# Altium schematic sheet MiniBMS.SchDoc
size A2; SheetNumber: 1; SheetTotal: 1
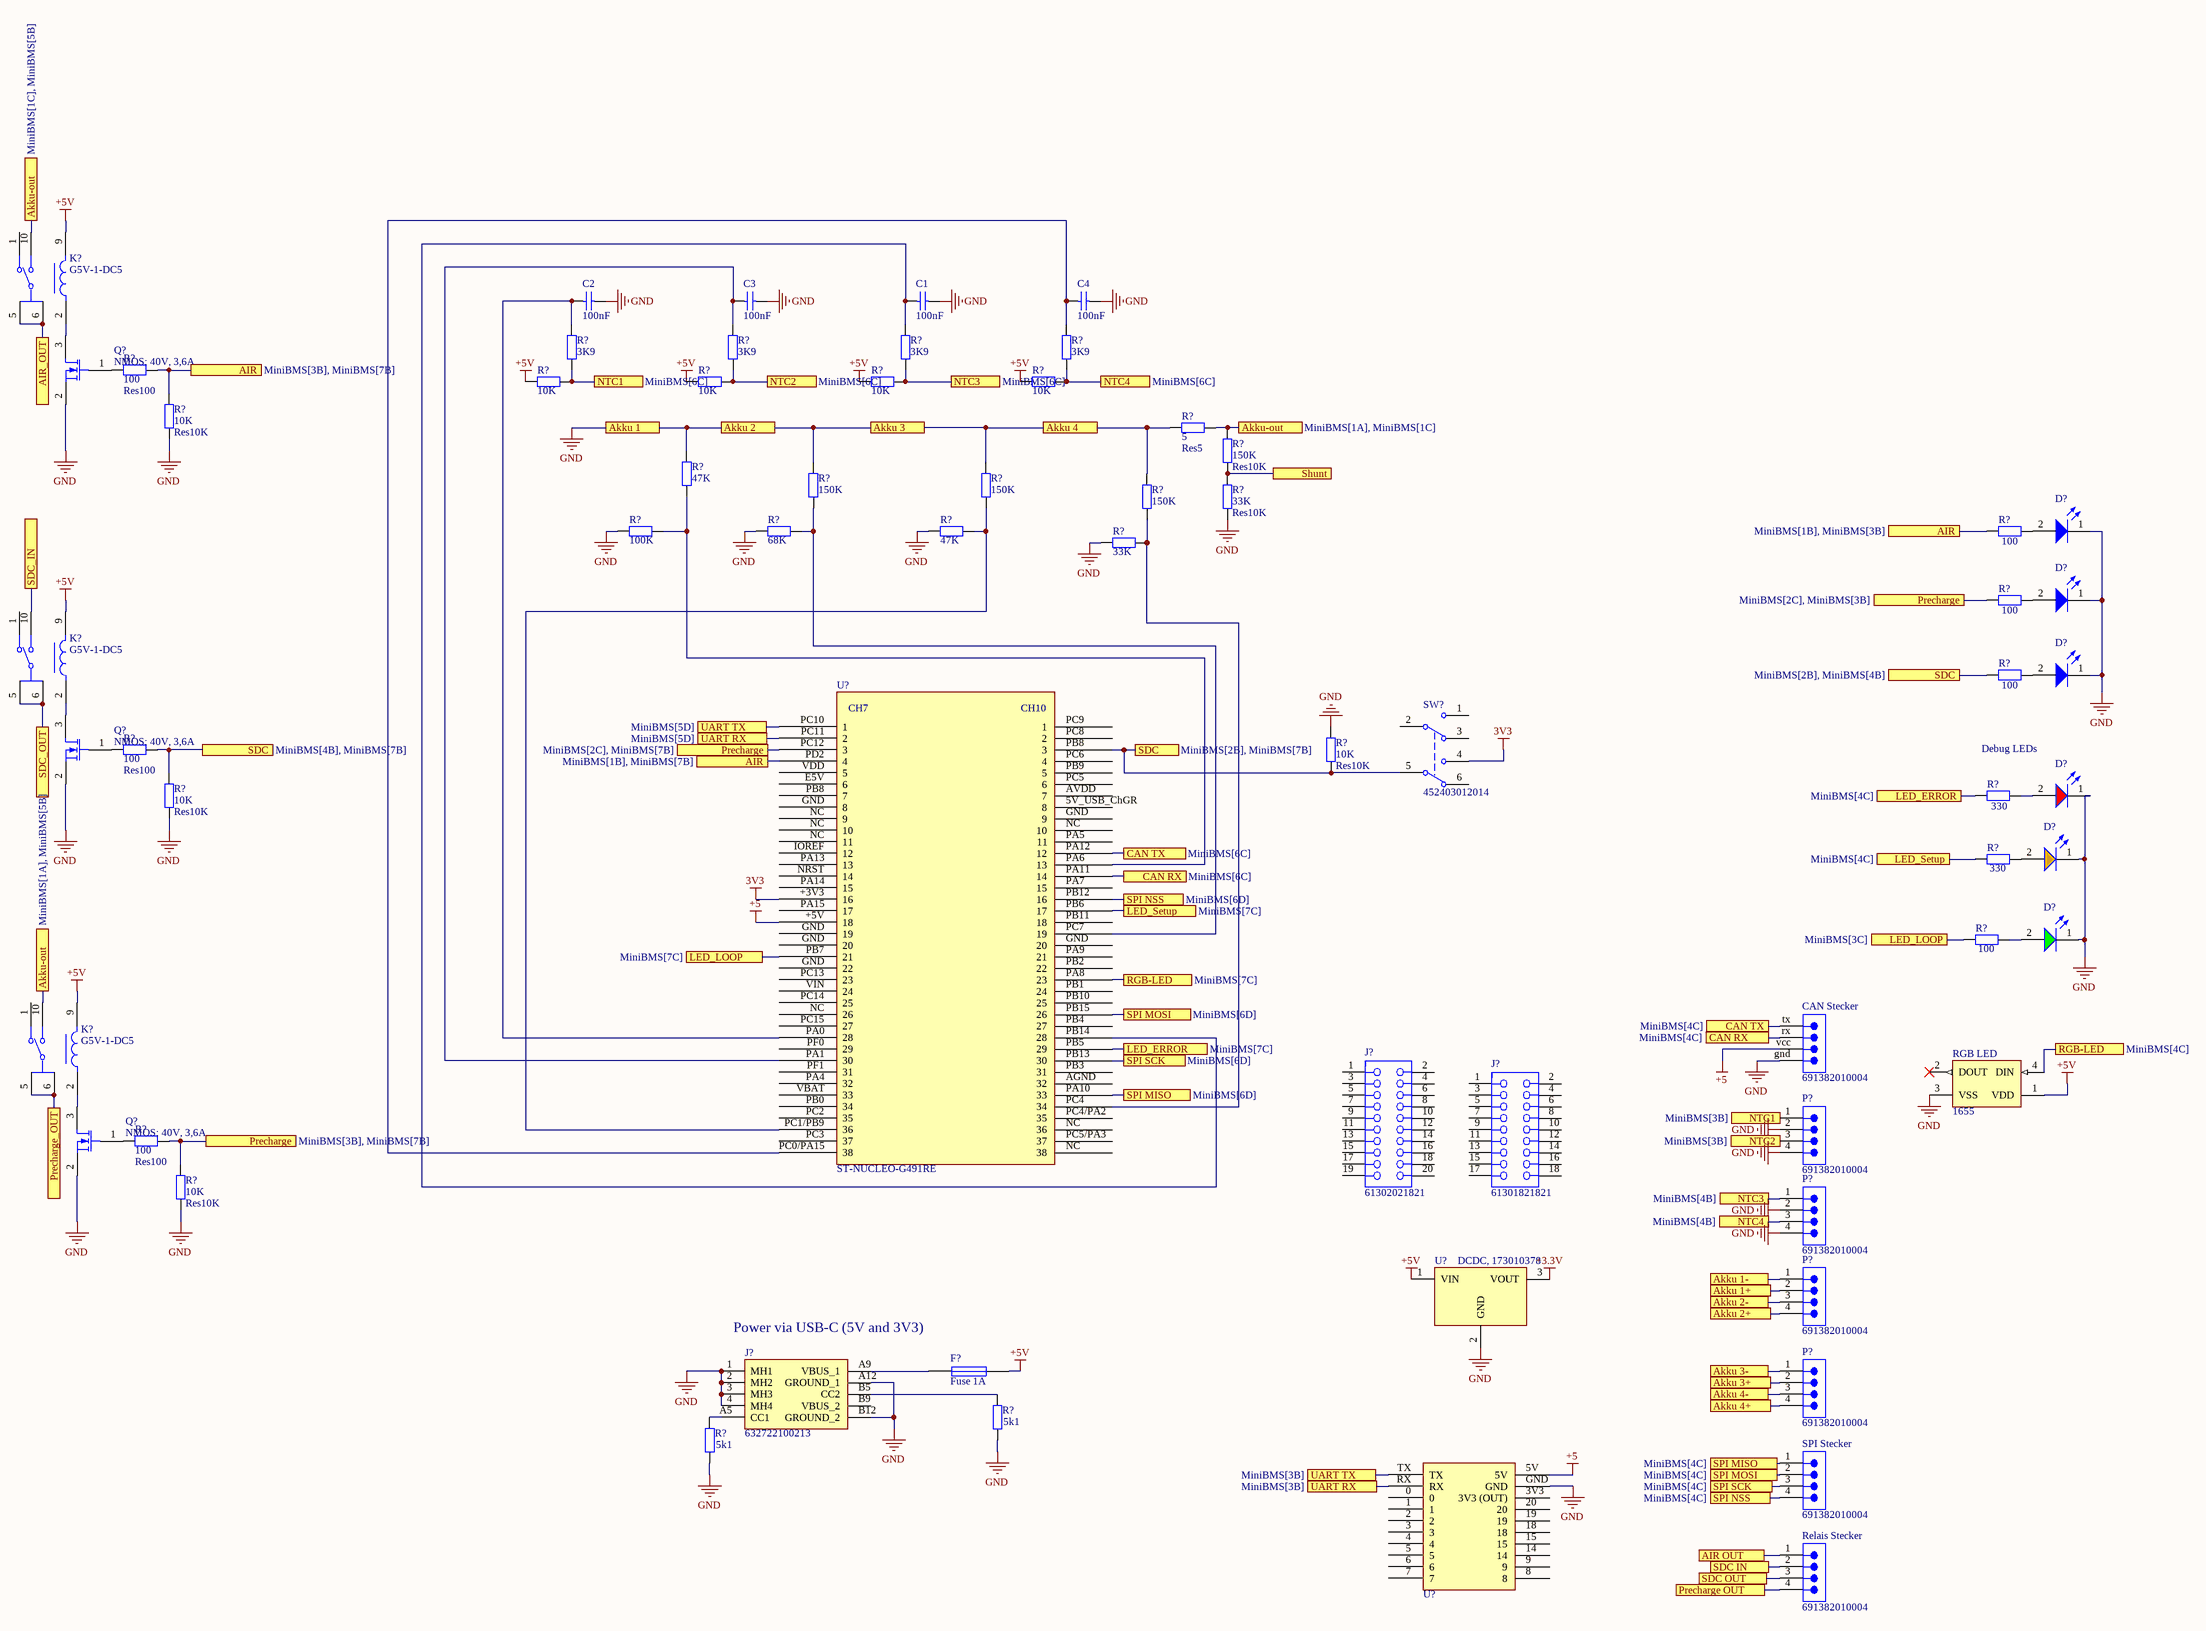
[diagram p0: MiniBMS.SchDoc]

## Parts
(Parts that share a designator on the sheet are numbered #1, #2 ... from top to bottom, then left to right.)
C1  value 100nF  (hidden comment: Capacitor)
C2  value 100nF  (hidden comment: Capacitor)
C3  value 100nF  (hidden comment: Capacitor)
C4  value 100nF  (hidden comment: Capacitor)
CAN_Stecker  691382010004  [691382010004]
D?#1  150080BS75000  [WL-SMCW_0805_150080xx75000]  (value not drawn)
D?#2  150080BS75000  [WL-SMCW_0805_150080xx75000]  (value not drawn)
D?#3  150080BS75000  [WL-SMCW_0805_150080xx75000]  (value not drawn)
D?#4  150080RS75000  [WL-SMCW_0805_150080xx75000]  (value not drawn)
D?#5  150080AS75000  [WL-SMCW_0805_150080xx75000]  (value not drawn)
D?#6  150080GS75000  [WL-SMCW_0805_150080xx75000]  (value not drawn)
F?  Fuse 1A  [OMT125]
J?#1  61302021821  [61302021821]
J?#2  61301821821  [61301821821]
J?#3  632722100213  [632722100213]
K?#1  G5V-1-DC5  [FP-G5V-1-MFG]
K?#2  G5V-1-DC5  [FP-G5V-1-MFG]
K?#3  G5V-1-DC5  [FP-G5V-1-MFG]
P?#1  691382010004  [691382010004]
P?#2  691382010004  [691382010004]
P?#3  691382010004  [691382010004]
P?#4  691382010004  [691382010004]
Q?#1  NMOS; 40V, 3,6A  [SOT-23_M]
Q?#2  NMOS; 40V, 3,6A  [SOT-23_M]
Q?#3  NMOS; 40V, 3,6A  [SOT-23_M]
R?#1  value 3K9  [6-0805_M]
R?#2  value 3K9  [6-0805_M]
R?#3  value 3K9  [6-0805_M]
R?#4  value 3K9  [6-0805_M]
R?#5  value 10K  [6-0805_M]
R?#6  value 10K  [6-0805_M]
R?#7  value 10K  [6-0805_M]
R?#8  value 10K  [6-0805_M]
R?#9  Res100  value 100  [6-0805_M]
R?#10  Res5  value 5  [6-0805_M]
R?#11  Res10K  value 10K  [6-0805_M]
R?#12  value 47K  [6-0805_M]
R?#13  Res10K  value 150K  [6-0805_M]
R?#14  value 150K  [6-0805_M]
R?#15  value 150K  [6-0805_M]
R?#16  value 150K  [6-0805_M]
R?#17  Res10K  value 33K  [6-0805_M]
R?#18  value 100K  [6-0805_M]
R?#19  value 68K  [6-0805_M]
R?#20  value 47K  [6-0805_M]
R?#21  value 100  [6-0805_M]  (hidden comment: Res100,0805)
R?#22  value 33K  [6-0805_M]
R?#23  value 100  [6-0805_M]  (hidden comment: Res100,0805)
R?#24  value 100  [6-0805_M]  (hidden comment: Res100,0805)
R?#25  Res100  value 100  [6-0805_M]
R?#26  Res10K  value 10K  [6-0805_M]
R?#27  value 330  [6-0805_M]  (hidden comment: Res330,0805)
R?#28  Res10K  value 10K  [6-0805_M]
R?#29  value 330  [6-0805_M]  (hidden comment: Res330,0805)
R?#30  value 100  [6-0805_M]  (hidden comment: Res100,0805)
R?#31  Res100  value 100  [6-0805_M]
R?#32  Res10K  value 10K  [6-0805_M]
R?#33  value 5k1  [6-0805_M]  (hidden comment: Res5k1,0805)
R?#34  value 5k1  [6-0805_M]  (hidden comment: Res5k1,0805)
Relais_Stecker  691382010004  [691382010004]
RGB_LED  1655  [ADA-RGB-1655_V]
SPI_Stecker  691382010004  [691382010004]
SW?  452403012014  [452403012014]
U?#1  ST-NUCLEO-G491RE  [NUCLEO-G491RE]
U?#2  DCDC, 173010378  [WPME-FDSM_SIP-3_L11.6W8.5H10.5]
U?#3  EP32_C6_Mini  [ESP_C6_Mini]  (value not drawn)

## Ports
AIR (see MiniBMS[1B], MiniBMS[3B]), AIR (see MiniBMS[1B], MiniBMS[7B]), AIR (see MiniBMS[3B], MiniBMS[7B]), AIR OUT, AIR_OUT, Akku 1, Akku 1+, Akku 1-, Akku 2, Akku 2+, Akku 2-, Akku 3, Akku 3+, Akku 3-, Akku 4, Akku 4+, Akku 4-, Akku-out (see MiniBMS[1A], MiniBMS[1C]), Akku-out (see MiniBMS[1A], MiniBMS[5B]), Akku-out (see MiniBMS[1C], MiniBMS[5B]), CAN RX (see MiniBMS[4C]), CAN RX (see MiniBMS[6C]), CAN TX (see MiniBMS[4C]), CAN TX (see MiniBMS[6C]), LED_ERROR (see MiniBMS[4C]), LED_ERROR (see MiniBMS[7C]), LED_LOOP (see MiniBMS[3C]), LED_LOOP (see MiniBMS[7C]), LED_Setup (see MiniBMS[4C]), LED_Setup (see MiniBMS[7C]), NTC1 (see MiniBMS[3B]), NTC1 (see MiniBMS[6C]), NTC2 (see MiniBMS[3B]), NTC2 (see MiniBMS[6C]), NTC3 (see MiniBMS[4B]), NTC3 (see MiniBMS[6C]), NTC4 (see MiniBMS[4B]), NTC4 (see MiniBMS[6C]), Precharge (see MiniBMS[2C], MiniBMS[3B]), Precharge (see MiniBMS[2C], MiniBMS[7B]), Precharge (see MiniBMS[3B], MiniBMS[7B]), Precharge OUT, Precharge_OUT, RGB-LED (see MiniBMS[4C]), RGB-LED (see MiniBMS[7C]), SDC (see MiniBMS[2B], MiniBMS[4B]), SDC (see MiniBMS[2B], MiniBMS[7B]), SDC (see MiniBMS[4B], MiniBMS[7B]), SDC IN, SDC OUT, SDC_IN, SDC_OUT, Shunt, SPI MISO (see MiniBMS[4C]), SPI MISO (see MiniBMS[6D]), SPI MOSI (see MiniBMS[4C]), SPI MOSI (see MiniBMS[6D]), SPI NSS (see MiniBMS[4C]), SPI NSS (see MiniBMS[6D]), SPI SCK (see MiniBMS[4C]), SPI SCK (see MiniBMS[6D]), UART RX (see MiniBMS[3B]), UART RX (see MiniBMS[5D]), UART TX (see MiniBMS[3B]), UART TX (see MiniBMS[5D])

## Nets
3V3: SW?.4 U?#1.+3V3(16)
+3.3V: U?#2.3(VOUT)
+5: CAN_Stecker.vcc U?#1.+5V(18) U?#3.5V
+5V: F?.2 K?#1.9 K?#2.9 K?#3.9 R?#5.2 R?#6.2 R?#7.2 R?#8.2 RGB_LED.1(VDD) U?#2.1(VIN)
GND: C1.1 C2.1 C3.1 C4.1 CAN_Stecker.gnd D?#1.1(K) D?#2.1(K) D?#3.1(K) D?#4.1(K) D?#5.1(K) D?#6.1(K) J?#3.1(MH1) J?#3.2(MH2) J?#3.3(MH3) J?#3.4(MH4) J?#3.A12(GROUND_1) J?#3.B12(GROUND_2) P?#1.2 P?#1.4 P?#2.2 P?#2.4 Q?#1.2(S) Q?#2.2(S) Q?#3.2(S) R?#10.2 R?#11.1 R?#12.1 R?#14.1 R?#15.1 R?#16.1 R?#17.1 R?#18.2 R?#19.2 R?#20.2 R?#22.2 R?#26.2 R?#28.1 R?#32.1 R?#33.2 R?#34.2 RGB_LED.3(VSS) U?#2.2(GND) U?#3.GND ; port Akku 1, port Akku 2, port Akku 3, port Akku 4
AIR: R?#9.2 R?#11.2 R?#21.1 U?#1.PD2(4) ; port AIR
AIR OUT: Relais_Stecker.1 ; port AIR OUT
AIR_OUT: K?#1.5 K?#1.6 ; port AIR_OUT
Akku 1+: P?#3.2 ; port Akku 1+
Akku 1-: P?#3.1 ; port Akku 1-
Akku 2+: P?#3.4 ; port Akku 2+
Akku 2-: P?#3.3 ; port Akku 2-
Akku 3+: P?#4.2 ; port Akku 3+
Akku 3-: P?#4.1 ; port Akku 3-
Akku 4+: P?#4.4 ; port Akku 4+
Akku 4-: P?#4.3 ; port Akku 4-
Akku-out: K?#1.10 K?#3.10 R?#10.1 R?#13.2 ; port Akku-out
CAN RX: CAN_Stecker.rx U?#1.PA11(14) ; port CAN RX
CAN TX: CAN_Stecker.tx U?#1.PA12(12) ; port CAN TX
LED_ERROR: R?#27.1 U?#1.PB5(29) ; port LED_ERROR
LED_LOOP: R?#30.1 U?#1.PB7(21) ; port LED_LOOP
LED_Setup: R?#29.1 U?#1.PB6(17) ; port LED_Setup
NTC1: P?#1.1 R?#1.1 R?#5.1 ; port NTC1
NTC2: P?#1.3 R?#2.1 R?#6.1 ; port NTC2
NTC3: P?#2.1 R?#3.1 R?#7.1 ; port NTC3
NTC4: P?#2.3 R?#4.1 R?#8.1 ; port NTC4
Precharge: R?#23.1 R?#31.2 R?#32.2 U?#1.PC12(3) ; port Precharge
Precharge OUT: Relais_Stecker.4 ; port Precharge OUT
Precharge_OUT: K?#3.5 K?#3.6 ; port Precharge_OUT
RGB-LED: RGB_LED.4(DIN) U?#1.PA8(23) ; port RGB-LED
SDC: R?#24.1 R?#25.2 R?#26.1 R?#28.2 SW?.5(COM) U?#1.PB8(7) ; port SDC
SDC IN: Relais_Stecker.2 ; port SDC IN
SDC OUT: Relais_Stecker.3 ; port SDC OUT
SDC_IN: K?#2.10 ; port SDC_IN
SDC_OUT: K?#2.5 K?#2.6 ; port SDC_OUT
Shunt: R?#13.1 R?#17.2 ; port Shunt
SPI MISO: SPI_Stecker.1 U?#1.PA10(33) ; port SPI MISO
SPI MOSI: SPI_Stecker.2 U?#1.PB15(26) ; port SPI MOSI
SPI NSS: SPI_Stecker.4 U?#1.PB12(16) ; port SPI NSS
SPI SCK: SPI_Stecker.3 U?#1.PB13(30) ; port SPI SCK
UART RX: U?#1.PC11(2) U?#3.RX ; port UART RX
UART TX: U?#1.PC10(1) U?#3.TX ; port UART TX
NetC1_2: C1.2 R?#3.2 U?#1.PB14(28)
NetC2_2: C2.2 R?#1.2 U?#1.PA0(28)
NetC3_2: C3.2 R?#2.2 U?#1.PA1(30)
NetC4_2: C4.2 R?#4.2 U?#1.PC0/PA15(38)
NetD?#1_2: D?#1.2(A) R?#21.2
NetD?#2_2: D?#2.2(A) R?#23.2
NetD?#3_2: D?#3.2(A) R?#24.2
NetD?#4_2: D?#4.2(A) R?#27.2
NetD?#5_2: D?#5.2(A) R?#29.2
NetD?#6_2: D?#6.2(A) R?#30.2
NetF?_1: F?.1 J?#3.A9(VBUS_1)
NetJ?#3_A5: J?#3.A5(CC1) R?#34.1
NetJ?#3_B5: J?#3.B5(CC2) R?#33.1
NetK?#1_2: K?#1.2 Q?#1.3(D)
NetK?#2_2: K?#2.2 Q?#2.3(D)
NetK?#3_2: K?#3.2 Q?#3.3(D)
NetQ?#1_1: Q?#1.1(G) R?#9.1
NetQ?#2_1: Q?#2.1(G) R?#25.1
NetQ?#3_1: Q?#3.1(G) R?#31.1
NetR?#12_2: R?#12.2 R?#18.1 U?#1.PA6(13)
NetR?#14_2: R?#14.2 R?#19.1 U?#1.PC7(19)
NetR?#15_2: R?#15.2 R?#20.1 U?#1.PC1/PB9(36)
NetR?#16_2: R?#16.2 R?#22.1 U?#1.PC4(34)

Not connected (* = marked no-connect by the designer): J?#1 1 2 3 4 5 6 7 8 9 10 11 12 13 14 15 16 17 18 19 20; J?#2 1 2 3 4 5 6 7 8 9 10 11 12 13 14 15 16 17 18; J?#3 B9(VBUS_2); K?#1 1; K?#2 1; K?#3 1; RGB_LED 2(DOUT)*; SW? 1 2(COM) 3 6; U?#1 5V_USB_ChGR(8) AGND(32) AVDD(7) E5V(6) GND(19) IOREF(12) NC(26) NRST(14) PA4(32) PA5(11) PA7(15) PA9(21) PA13(13) PA14(15) PA15(17) PB0(34) PB1(24) PB2(22) PB3(31) PB4(27) PB9(5) PB10(25) PB11(18) PC2(35) PC3(37) PC4/PA2(35) PC5(6) PC5/PA3(37) PC6(4) PC8(2) PC9(1) PC13(23) PC14(25) PC15(27) PF0(29) PF1(31) VBAT(33) VDD(5) VIN(24); U?#3 0 1 2 3 3V3(3V3_(OUT)) 4 5 6 7 8 9 14 15 18 19 20

## Notes on the sheet
- Debug LEDs
- Power via USB-C (5V and 3V3)
- (in symbol NUCLEO-G491RE) CH7; CH10

## Library data of the parts
C1-C4 = Capacitor: SimulationGenericComponent: True
CAN_Stecker P?#1-P?#4 Relais_Stecker SPI_Stecker = CMP-1502-01745-2: NexarPartId: 52676066; Current: 12A; Pitch: 2.4892mm; Gender: Male; Number of Levels: 1; Number of Positions: 4; Voltage: 300V; Termination: Solder; RoHS: Compliant; Packaging: Box; Color: Green; Lead Pitch: 2.5mm; Number of Pins: 4; Mount: Through Hole; Number of Positions Per Level: 4; Contact Plating: Tin; Min Operating Temperature: -40°C; Max Operating Temperature: 105°C
D?#1-D?#3 = CMP-1426-00008-6: NexarPartId: 29717779; Test Current: 20mA; Lens Style: Clear, Rectangular; Forward Current: 100mA; Power Dissipation: 105mW; Dominant Wavelength: 470nm; Reverse Voltage: 5V; Viewing Angle: 140°; Luminous Intensity: 145mcd; Color: Blue; Forward Voltage: 3.2V; Max Junction Temperature (Tj): 95°C; Peak Wavelength: 465nm; Min Operating Temperature: -40°C; Mount: Surface Mount; Case Code (Imperial): 0805; Packaging: Tape and Reel; Lead Free: Lead Free; Length: 2mm; Case/Package: 0805; Case Code (Metric): 2012; Max Operating Temperature: 85°C; Height: 700µm; RoHS: Compliant; Max Reverse Voltage (DC): 5V; REACH SVHC: Unknown; Width: 1.25mm; Wavelength: 470nm
D?#4 = CMP-1426-00011-3: LED Uni-Color Red 630nm 2-Pin Chip 0805(2012Metric) T/R; Wavelength: 625nm; Viewing Angle: 140°; Test Current: 20mA; Forward Voltage: 2V; Forward Current: 100mA; Lens Style: Clear, Rectangular; Luminous Intensity: 150mcd; Max Reverse Voltage (DC): 5V; Max Junction Temperature (Tj): 95°C; Power Dissipation: 72mW; Peak Wavelength: 630nm; Length: 2mm; Case Code (Imperial): 0805; RoHS: Compliant; Max Operating Temperature: 85°C; Height: 700µm; Packaging: Tape and Reel; Color: Red; Case/Package: 0805; REACH SVHC: Unknown; Dominant Wavelength: 625nm; Min Operating Temperature: -40°C; Case Code (Metric): 2012; Mount: Surface Mount; Width: 1.25mm
D?#5 = CMP-03913-89970695-1: 150080AS75000 WL-SMCW SMT Mono-Color Chip LED Waterclear; Luminous Intensity: 130mcd; Dominant Wavelength: 605nm; Viewing Angle: 140°; Max Reverse Voltage (DC): 5V; Forward Current: 100mA; Peak Wavelength: 610nm; Forward Voltage: 2V; Max Operating Temperature: 85°C; Min Operating Temperature: -40°C; NexarPartId: 89970695; Packaging: Tape and Reel; RoHS: Compliant; Wavelength: 605nm
D?#6 = CMP-1426-00007-2: NexarPartId: 29717780; Wavelength: 520nm; Forward Current: 100mA; Lens Style: Clear, Rectangular; Dominant Wavelength: 525nm; Max Junction Temperature (Tj): 95°C; Power Dissipation: 105mW; Luminous Intensity: 450mcd; Peak Wavelength: 515nm; Color: Green; Viewing Angle: 140°; Test Current: 20mA; Reverse Voltage: 5V; Forward Voltage: 3.2V; Mount: Surface Mount; REACH SVHC: Unknown; Min Operating Temperature: -40°C; Case Code (Imperial): 0805; Case/Package: 0805; Max Operating Temperature: 85°C; RoHS: Compliant; Length: 2mm; Height: 700µm; Width: 1.25mm; Case Code (Metric): 2012; Packaging: Tape and Reel; Max Reverse Voltage (DC): 5V
F? = Fuse 1: Fuse; Published: 8-Jun-2000; LatestRevisionDate: 17-Jul-2002; LatestRevisionNote: Re-released for DXP Platform.; PackageReference: PIN-W2/E2.8; Publisher: Altium Limited; PackageDescription: Thru-Hole; 2 Leads
J?#1 = CMP-1502-01350-3: NexarPartId: 61924746; Current Rating: 3A; Operating Supply Voltage: 250V; Gender: Female; Contact Resistance: 20mΩ; RoHS: Non-Compliant; Orientation: Vertical; Number of Pins: 20; Lead Pitch: 2.54mm
J?#2 = CMP-1502-01347-3: NexarPartId: 61924743; Gender: Female; Current Rating: 3A; Operating Supply Voltage: 250V; Contact Resistance: 20mΩ; Orientation: Vertical; RoHS: Non-Compliant; Lead Pitch: 2.54mm; Number of Pins: 18
J?#3 = 632722100213: Connector; Manufacturer_Name: Wurth Elektronik; Datasheet Link: https://www.we-online.com/components/products/datasheet/632722100213.pdf; Height: 3.28mm; Manufacturer_Part_Number: 632722100213
K?#1-K?#3 = CMP-2000-05293-2: RELAY GEN PURPOSE SPDT 1A 5VDC; Manufacturer: Omron; Coil Power: 150mW; Coil Voltage: 5V; Standoff Height: 0.5mm; Coil Type: Non-Latching; Coil Resistance: 167Ω; Number Of Contacts: 1; Coil Current: 30mA; Current Rating: 2A; Temperature: -40°C to +70°C; Manufacturer Part Number: G5V-1-DC5; Lead Free: Yes; RoHS: TRUE; Category: Relay; ComponentLink2Description: Datasheet; Ambient Temperature Range Low: -40°C; Digikey Description: RELAY GEN PURPOSE SPDT 1A 5VDC; Temperature Range High: +70°C; Package: G5V-1; Throw Configuration: SPDT; Switching Current: 1A; Height: 10mm; Device Class L2: Relays; Ambient Temperature Range High: +70°C; Temperature Range Low: -40°C; Octopart: https://octopart.com/g5v-1-dc5-omron-6846; Device Class L1: Electromechanical; ComponentLink2URL: https://omronfs.omron.com/en_US/ecb/products/pdf/en-g5v_1.pdf; Automotive: No; Device Class L3: Signal Relays
Q?#1-Q?#3 = MOSFET-N: N-Channel MOSFET; Published: 8-Jun-2000; LatestRevisionDate: 17-Jul-2002; LatestRevisionNote: Re-released for DXP Platform.; PackageVersion: 1995/1996; PackageReference: E3; Publisher: Altium Limited; PackageDescription: TO, Flat Index; 3 In-Line, Axial Leads; Body Dia. 4.6mm; Lead Dia. 0.5 mm (max)
R?#1-R?#34 = Res2: Resistor; Published: 8-Jun-2000; LatestRevisionDate: 17-Jul-2002; LatestRevisionNote: Re-released for DXP Platform.; PackageReference: AXIAL-0.4; Publisher: Altium Limited; PackageDescription: Axial Device, Thru-Hole; 2 Leads; 0.4 in Pin Spacing
RGB_LED = CMP-2000-05026-1: Intelligent Control LED Integrated Light Source, 3.5 to 5.3 V, -25 to 80 degC, 4-Pin SMD, RoHS, Tape and Reel; Manufacturer: Adafruit-Industries-LLC; Number of LEDs: 10; Configuration: Discrete; Utilized LED: WS2812(5050); Datasheet URL: http://datasheet.octopart.com/ADA1655-Adafruit-Industries-datasheet-32028139.pdf; Series: Neopixel; Interface: -; Package Description: 4-Pin Surface Mount Device, Body 5 x 5 mm; Color: Red,Green,Blue(RGB); Category: Optoelectronics; Controller Type: -; Package Reference: 1655; Manufacturer URL: https://www.adafruit.com/; Mounting Type: SurfaceMount; Datasheet Version: May-13; Size / Dimension: 5.00mmLx5.00mmW; Family: Addressable,Specialty
SW? = CMP-03913-71472420-1: 452403012014 Slide Switch, Dpdt, 0.3A, 6Vdc, Smd Rohs Compliant: Yes; Voltage Rating: 6V; Switch Function: On-On; Actuator Length: 1.2mm; Switch Travel: 2mm; Current Rating: 300mA; Insulation Resistance: 100MΩ; Actuator Material: Liquid Crystal Polymer, Polymer; Contact Style: Non-Shorting; Termination: SMD/SMT; Mount: Surface Mount; Min Operating Temperature: -40°C; Contact Plating: Silver; RoHS: Compliant; Color: Silver; Throw Configuration: DPDT; Voltage Rating (DC): 6V; Max Operating Temperature: 85°C; NexarPartId: 71472420; Packaging: Tape and Reel
U?#1 = NUCLEO-G491RE: STM32 Nucleo-64 development board with STM32G491RE MCU
U?#2 = CMP-03913-70856726-1: 173010378 WPME-FDSM Fixed Step Down Regulator Module; Switching Frequency: 300kHz; Max Output Current: 1A; Max Output Voltage: 3.3V; Efficiency: 87%; Max Power Dissipation: 3W; Max Input Voltage: 28V; Min Input Voltage: 7V; Number of Outputs: 1; Output Power: 3.3W; Number of Pins: 3; REACH SVHC: Unknown; Mount: Through Hole; Height: 10.5mm; Voltage - Output 1: 3.3V; Nominal Output Voltage: 3.3V; Output Voltage: 3.3V; Output Current: 1A; Case/Package: Module; NexarPartId: 70856726; Max Operating Temperature: 85°C; Min Operating Temperature: -40°C; Width: 8.5mm; Length: 11.6mm; Max Switching Frequency: 300kHz; RoHS: Compliant; Output Type: Fixed; Features: OCP, OTP, OVP, SCP